# Altium schematic sheet main_diagram.SchDoc: Diagrama Geral
size A4; Engineer: Amós Nunes; Organization: occhi; SheetNumber: 1; SheetTotal: 5; Tamanho: A4; Equipament: E. T. Wheelchair
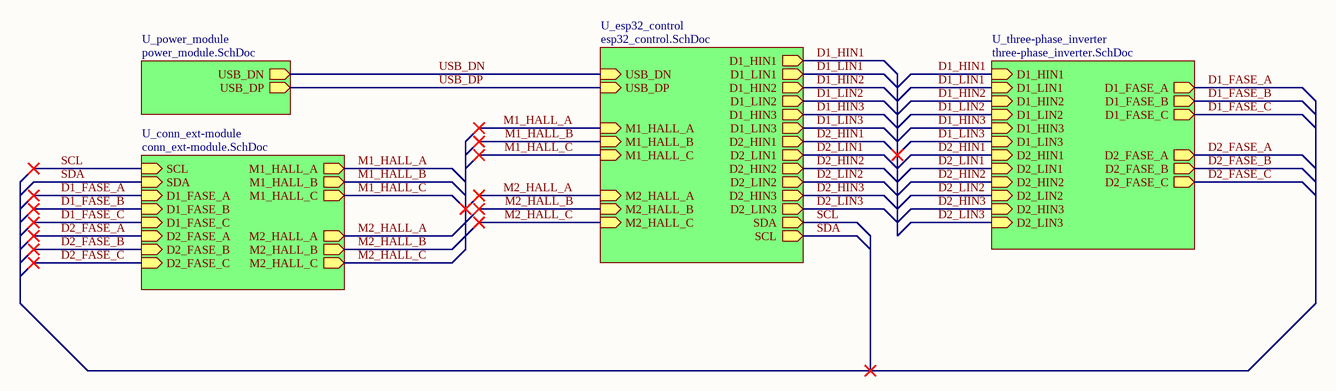
[diagram p0: main_diagram.SchDoc]

## Sub-sheets
U_conn_ext-module = conn_ext-module.SchDoc: SCL (in), SDA (in), M1_HALL_B (out), M1_HALL_C (out), M1_HALL_A (out), D1_FASE_C (in), D1_FASE_B (in), D1_FASE_A (in), M2_HALL_B (out), M2_HALL_C (out), M2_HALL_A (out), D2_FASE_C (in), D2_FASE_B (in), D2_FASE_A (in)
U_esp32_control = esp32_control.SchDoc: USB_DN (in), USB_DP (in), M2_HALL_B (in), M2_HALL_C (in), M1_HALL_B (in), M1_HALL_C (in), M1_HALL_A (in), M2_HALL_A (in), SDA (out), SCL (out), D1_HIN1 (out), D1_LIN1 (out), D1_HIN2 (out), D1_LIN2 (out), D1_HIN3 (out), D1_LIN3 (out), D2_HIN1 (out), D2_LIN1 (out), D2_HIN2 (out), D2_LIN2 (out), D2_HIN3 (out), D2_LIN3 (out)
U_power_module = power_module.SchDoc: USB_DN (out), USB_DP (out)
U_three-phase_inverter = three-phase_inverter.SchDoc: D1_HIN1 (in), D1_LIN1 (in), D1_HIN2 (in), D1_LIN2 (in), D1_HIN3 (in), D1_LIN3 (in), D1_FASE_C (out), D1_FASE_B (out), D1_FASE_A (out), D2_HIN1 (in), D2_LIN1 (in), D2_HIN2 (in), D2_LIN2 (in), D2_HIN3 (in), D2_LIN3 (in), D2_FASE_C (out), D2_FASE_B (out), D2_FASE_A (out)

## Nets
D1_FASE_A: sheet U_three-phase_inverter/D1_FASE_A, sheet U_conn_ext-module/D1_FASE_A
D1_FASE_B: sheet U_three-phase_inverter/D1_FASE_B, sheet U_conn_ext-module/D1_FASE_B
D1_FASE_C: sheet U_three-phase_inverter/D1_FASE_C, sheet U_conn_ext-module/D1_FASE_C
D1_HIN1: sheet U_esp32_control/D1_HIN1, sheet U_three-phase_inverter/D1_HIN1
D1_HIN2: sheet U_esp32_control/D1_HIN2, sheet U_three-phase_inverter/D1_HIN2
D1_HIN3: sheet U_esp32_control/D1_HIN3, sheet U_three-phase_inverter/D1_HIN3
D1_LIN1: sheet U_esp32_control/D1_LIN1, sheet U_three-phase_inverter/D1_LIN1
D1_LIN2: sheet U_esp32_control/D1_LIN2, sheet U_three-phase_inverter/D1_LIN2
D1_LIN3: sheet U_esp32_control/D1_LIN3, sheet U_three-phase_inverter/D1_LIN3
D2_FASE_A: sheet U_three-phase_inverter/D2_FASE_A, sheet U_conn_ext-module/D2_FASE_A
D2_FASE_B: sheet U_three-phase_inverter/D2_FASE_B, sheet U_conn_ext-module/D2_FASE_B
D2_FASE_C: sheet U_three-phase_inverter/D2_FASE_C, sheet U_conn_ext-module/D2_FASE_C
D2_HIN1: sheet U_esp32_control/D2_HIN1, sheet U_three-phase_inverter/D2_HIN1
D2_HIN2: sheet U_esp32_control/D2_HIN2, sheet U_three-phase_inverter/D2_HIN2
D2_HIN3: sheet U_esp32_control/D2_HIN3, sheet U_three-phase_inverter/D2_HIN3
D2_LIN1: sheet U_esp32_control/D2_LIN1, sheet U_three-phase_inverter/D2_LIN1
D2_LIN2: sheet U_esp32_control/D2_LIN2, sheet U_three-phase_inverter/D2_LIN2
D2_LIN3: sheet U_esp32_control/D2_LIN3, sheet U_three-phase_inverter/D2_LIN3
M1_HALL_A: sheet U_esp32_control/M1_HALL_A, sheet U_conn_ext-module/M1_HALL_A
M1_HALL_B: sheet U_esp32_control/M1_HALL_B, sheet U_conn_ext-module/M1_HALL_B
M1_HALL_C: sheet U_esp32_control/M1_HALL_C, sheet U_conn_ext-module/M1_HALL_C
M2_HALL_A: sheet U_esp32_control/M2_HALL_A, sheet U_conn_ext-module/M2_HALL_A
M2_HALL_B: sheet U_esp32_control/M2_HALL_B, sheet U_conn_ext-module/M2_HALL_B
M2_HALL_C: sheet U_esp32_control/M2_HALL_C, sheet U_conn_ext-module/M2_HALL_C
SCL: sheet U_esp32_control/SDA, sheet U_conn_ext-module/SCL
SDA: sheet U_esp32_control/SCL, sheet U_conn_ext-module/SDA
USB_DN: sheet U_power_module/USB_DN, sheet U_esp32_control/USB_DN
USB_DP: sheet U_power_module/USB_DP, sheet U_esp32_control/USB_DP

## Notes on the sheet
- Title
- Size:
- Date:
- Equipament:
- Draw By:
- Sheet:
- Board:
- of:
- File: